# EAGLE design RS232 rev4 (EAGLE 7.5.0)
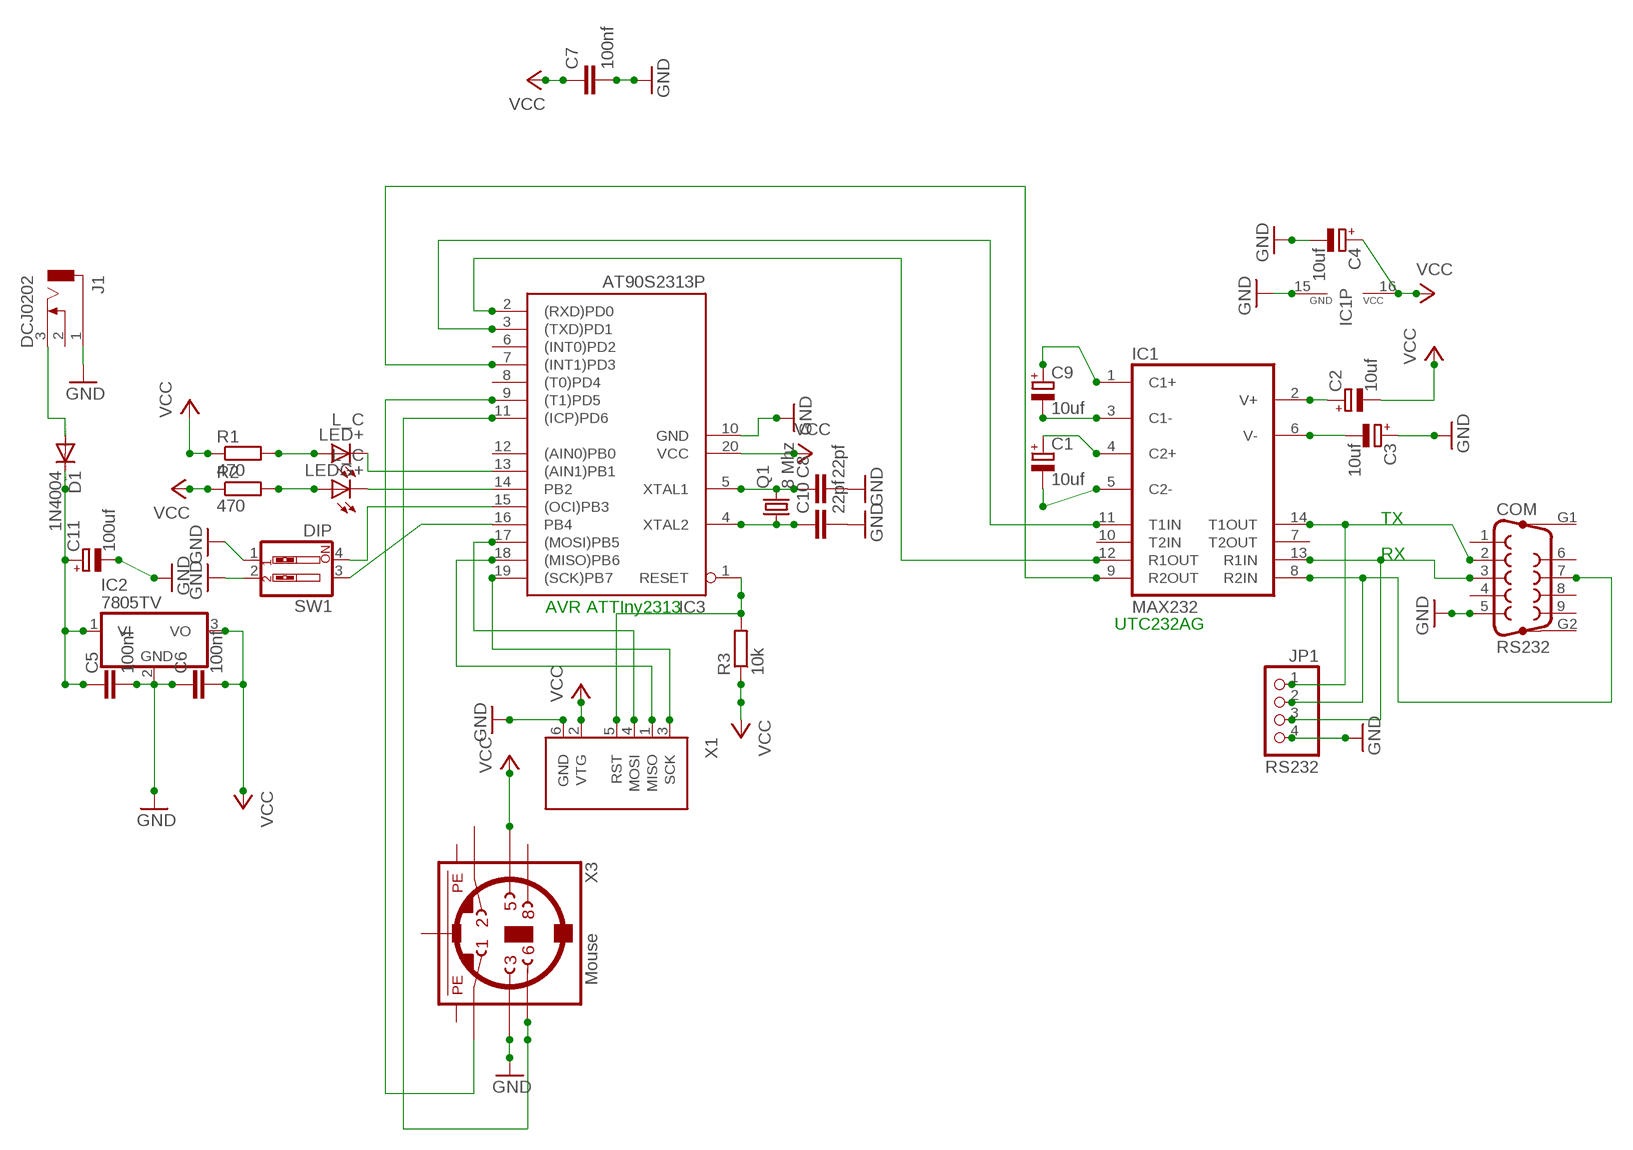
[diagram p0: schematic, sheet 1]

## Parts
C1  10uf  CPOL-EUTT2D4  [TT2D4]
C2  10uf  CPOL-EUTT2D4  [TT2D4]
C3  10uf  CPOL-EUTT2D4  [TT2D4]
C4  10uf  CPOL-EUTT2D4  [TT2D4]
C5  100nf  C-EUC1206  [C1206]
C6  100nf  C-EUC1206  [C1206]
C7  100nf  C-EUC1206  [C1206]
C8  22pf  C-EUC1206  [C1206]
C9  10uf  CPOL-EUTT2D4  [TT2D4]
C10  22pf  C-EUC1206  [C1206]
C11  100uf  CPOL-EUTT2D4  [TT2D4]
COM  RS232  F09HP  [F09HP]
D1  1N4004  [DO41-10]
IC1  MAX232  [DIL16]
IC2  7805TV  [TO220V]
IC3  AT90S2313P  [DIL20]
J1  DCJ0202  [DCJ0202]
JP1  RS232  PINHD-1X4  [1X04]
LED+  L_C  LED3MM  [LED3MM]
LEDG+  L_C  LED3MM  [LED3MM]
Q1  8 Mhz  CRYSTALHC49S  [HC49/S]
R1  470  R-EU_R1206  [R1206]
R2  470  R-EU_R1206  [R1206]
R3  10k  R-EU_R1206  [R1206]
SW1  DIP  SW_DIP-2  [EDG-02]
X1  AVRISP6PINHEADER  [6PINHEADER]
X3  Mouse  MINI_DIN_6  [M_DIN6]

## Nets
GND: C3.+ C4.- C5.2 C6.1 C7.2 C8.2 C10.2 C11.- COM.5 IC1.15(GND) IC2.2(GND) IC3.10(GND) J1.1 JP1.4 SW1.1 SW1.2 X1.6(GND) X3.3
N$1: IC1.11(T1IN) IC3.3((TXD)PD1)
N$2: IC1.12(R1OUT) IC3.2((RXD)PD0)
N$3: C9.- IC1.3(C1-)
N$4: C9.+ IC1.1(C1+)
N$5: C1.+ IC1.4(C2+)
N$6: C1.- IC1.5(C2-)
N$7: IC3.1(RESET) R3.2 X1.5(RST)
N$8: IC3.11((ICP)PD6) X3.6
N$9: COM.2 IC1.14(T1OUT) JP1.1
N$10: C5.1 C11.+ D1.C IC2.1(VI)
N$11: IC1.9(R2OUT) IC3.7((INT1)PD3)
N$12: C8.1 IC3.5(XTAL1) Q1.2
N$13: IC3.14(PB2) LEDG+.K(C)
N$14: C3.- IC1.6(V-)
N$15: C2.+ IC1.2(V+)
N$16: IC3.13((AIN1)PB1) LED+.K(C)
N$17: COM.3 IC1.13(R1IN) JP1.3
N$18: C10.1 IC3.4(XTAL2) Q1.1
N$19: IC3.16(PB4) SW1.3
N$20: LEDG+.A R2.2
N$21: LED+.A R1.2
N$22: IC3.9((T1)PD5) X3.1
N$23: IC3.15((OCI)PB3) SW1.4
N$24: IC3.19((SCK)PB7) X1.3(SCK)
N$26: IC3.17((MOSI)PB5) X1.4(MOSI)
N$27: IC3.18((MISO)PB6) X1.1(MISO)
POWER: D1.A J1.3
SERIAL#: COM.7 IC1.8(R2IN) JP1.2
VCC: C2.- C4.+ C6.2 C7.1 IC1.16(VCC) IC2.3(VO) IC3.20(VCC) R1.1 R2.1 R3.1 X1.2(VTG) X3.5
Unconnected: COM.1 COM.4 COM.6 COM.8 COM.9 COM.G1 COM.G2 IC1.7(T2OUT) IC1.10(T2IN) IC3.6((INT0)PD2) IC3.8((T0)PD4) IC3.12((AIN0)PB0) J1.2 X3.2 X3.8

## Notes on the sheet
- TX
- RX
- AVR ATTIny2313
- UTC232AG

## Power pins joined to a net without a drawn wire
PE1: X3.SH1(PE1)
PE2: X3.SH2(PE2)
PE3: X3.SH3(PE3)

## Library data of the parts
C1-C4 C9 C11 = rcl:CPOL-EU: POLARIZED CAPACITOR, European symbol
C5-C8 C10 = rcl:C-EU: CAPACITOR, European symbol
COM = con-subd:F09HP: SUB-D; OC_FARNELL: unknown; OC_NEWARK: unknown
D1 = diode:1N4004: DIODE general purpose rectifier, 1 A
IC1 = maxim:MAX232: RS232 TRANSCEIVER; MF: MAXIM; MPN: MAX232ACPE+; OC_FARNELL: 9723773; OC_NEWARK: 68K4544
IC2 = linear:78*: Positive VOLTAGE REGULATOR Source: http://cache.national.com/ds/LM/LM78L05.pdf http://www.fairchildsemi.com/ds/LM/LM7805.pdf
IC3 = atmel:AT90S2313: MICROCONTROLLER 2 Kbytes FLASH 128 bytes SRAM 128 bytes EEPROM UART; OC_FARNELL: unknown; OC_NEWARK: unknown
J1 = con-jack:DCJ0202: DC POWER JACK Source: DCJ0202.pdf; OC_FARNELL: unknown; OC_NEWARK: unknown
JP1 = pinhead:PINHD-1X4: PIN HEADER
LED+ LEDG+ = led:LED: LED OSRAM: - CHIPLED LG R971, LG N971, LY N971, LG Q971, LY Q971, LO R971, LY R971 LH N974, LH R974 LS Q976, LO Q976, LY Q976 LO Q996 - Hyper CHIPLED LW Q18S LB Q993, LB Q99A, LB R99A - SideLED LS A670, LO A670, LY A670, LG A670, LP A670 LB A673, LV A673, LT A673, LW A673 LH A674 LY A675 LS A676, LA A676, LO A676, LY A676, LW A676 LS A679, LY A679, LG A679 - Hyper Micro SIDELED® LS Y876, LA Y876, LO Y876, LY Y876 LT Y87S - SmartLED LW L88C, LW L88S LB L89C, LB L89S, LG L890 LS L89K, LO L89K, LY L89K LS L896, LA L896, LO L896, LY L896 - TOPLED LS T670, LO T670, LY T670, LG T670, LP T670 LSG T670, LSP T670, LSY T670, LOP T670, LYG T670 LG T671, LOG T671, LSG T671 LB T673, LV T673, LT T673, LW T673 LH T674 LS T676, LA T676, LO T676, LY T676, LB T676, LH T676, LSB T676, LW T676 LB T67C, LV T67C, LT T67C, LS T67K, LO T67K, LY T67K, LW E67C LS E67B, LA E67B, LO E67B, LY E67B, LB E67C, LV E67C, LT E67C LW T67C LS T679, LY T679, LG T679 LS T770, LO T770, LY T770, LG T770, LP T770 LB T773, LV T773, LT T773, LW T773 LH T774 LS E675, LA E675, LY E675, LS T675 LS T776, LA T776, LO T776, LY T776, LB T776 LHGB T686 LT T68C, LB T68C - Hyper Mini TOPLED® LB M676 - Mini TOPLED Santana® LG M470 LS M47K, LO M47K, LY M47K Source: http://www.osram.convergy.de LUXEON: - LUMILED® LXK2-PW12-R00, LXK2-PW12-S00, LXK2-PW14-U00, LXK2-PW14-V00 LXK2-PM12-R00, LXK2-PM12-S00, LXK2-PM14-U00 LXK2-PE12-Q00, LXK2-PE12-R00, LXK2-PE12-S00, LXK2-PE14-T00, LXK2-PE14-U00 LXK2-PB12-K00, LXK2-PB12-L00, LXK2-PB12-M00, LXK2-PB14-N00, LXK2-PB14-P00, LXK2-PB14-Q00 LXK2-PR12-L00, LXK2-PR12-M00, LXK2-PR14-Q00, LXK2-PR14-R00 LXK2-PD12-Q00, LXK2-PD12-R00, LXK2-PD12-S00 LXK2-PH12-R00, LXK2-PH12-S00 LXK2-PL12-P00, LXK2-PL12-Q00, LXK2-PL12-R00 Source: www.luxeon.com KINGBRIGHT: KA-3528ASYC Source: www.kingbright.com
Q1 = crystal:CRYSTAL: CRYSTAL; OC_FARNELL: 1667008; OC_NEWARK: unknown
R1-R3 = rcl:R-EU_: RESISTOR, European symbol
SW1 = special:SW_DIP-2: DIP SWITCH
X1 = avrisp:AVRISP6PIN
X3 = mini_din:MINI_DIN_6

## Board
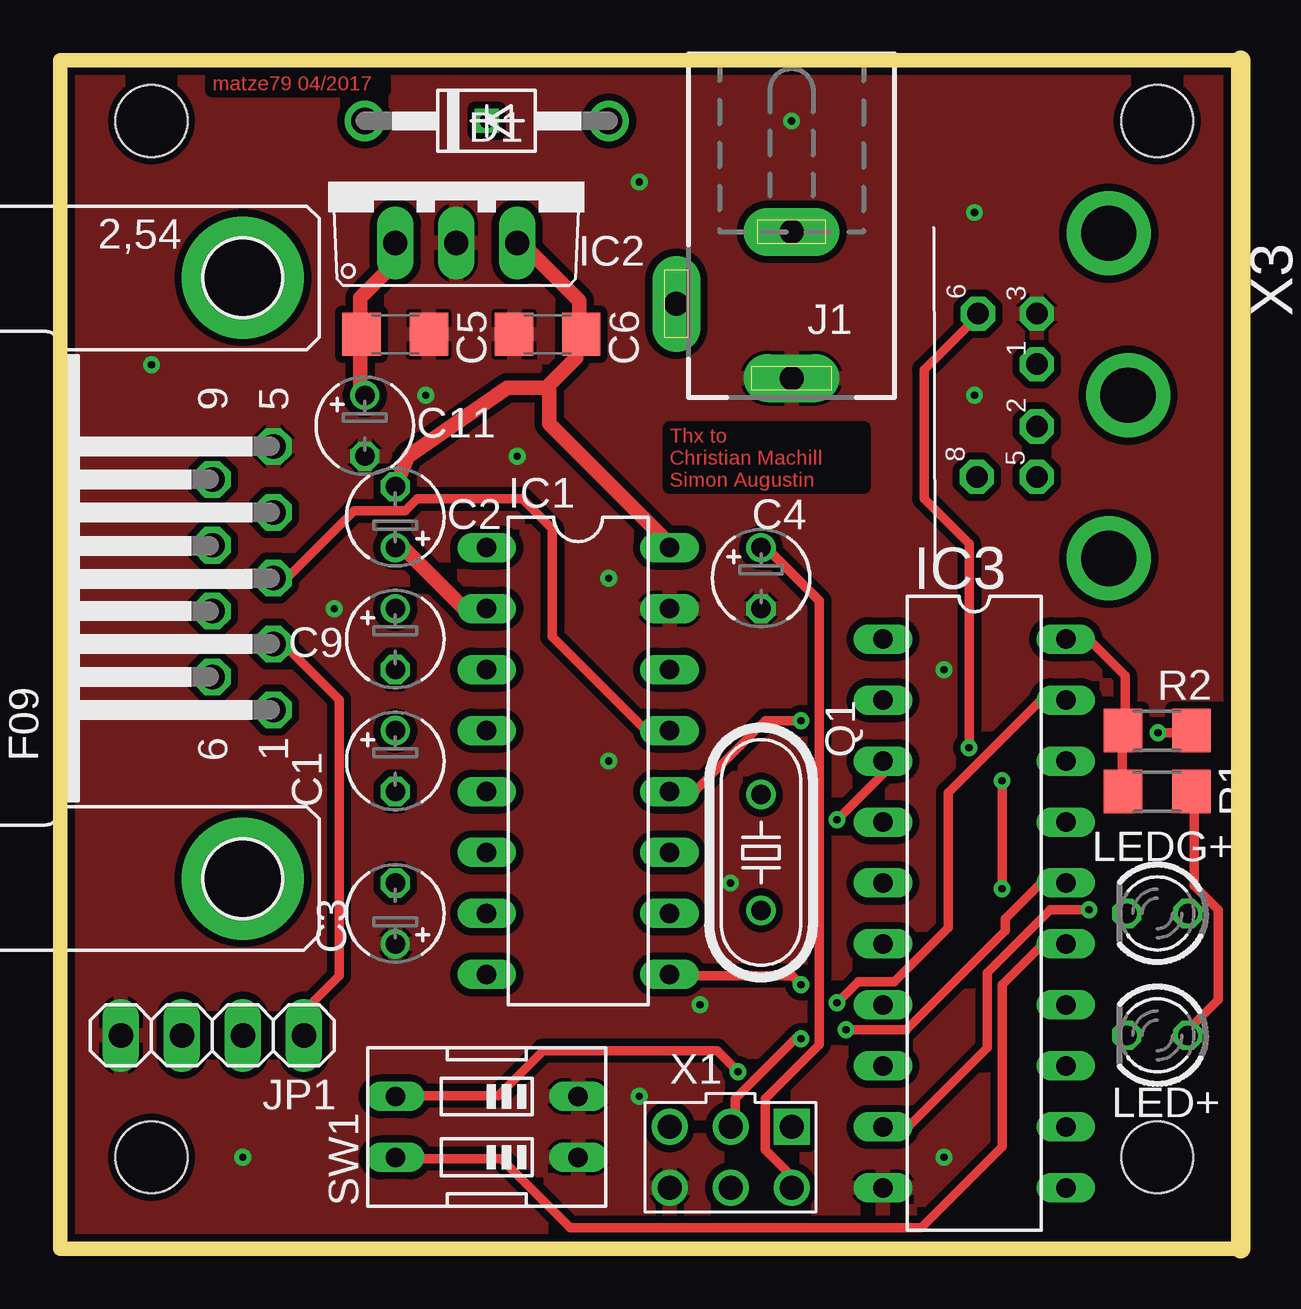
[diagram p1: board, top side]
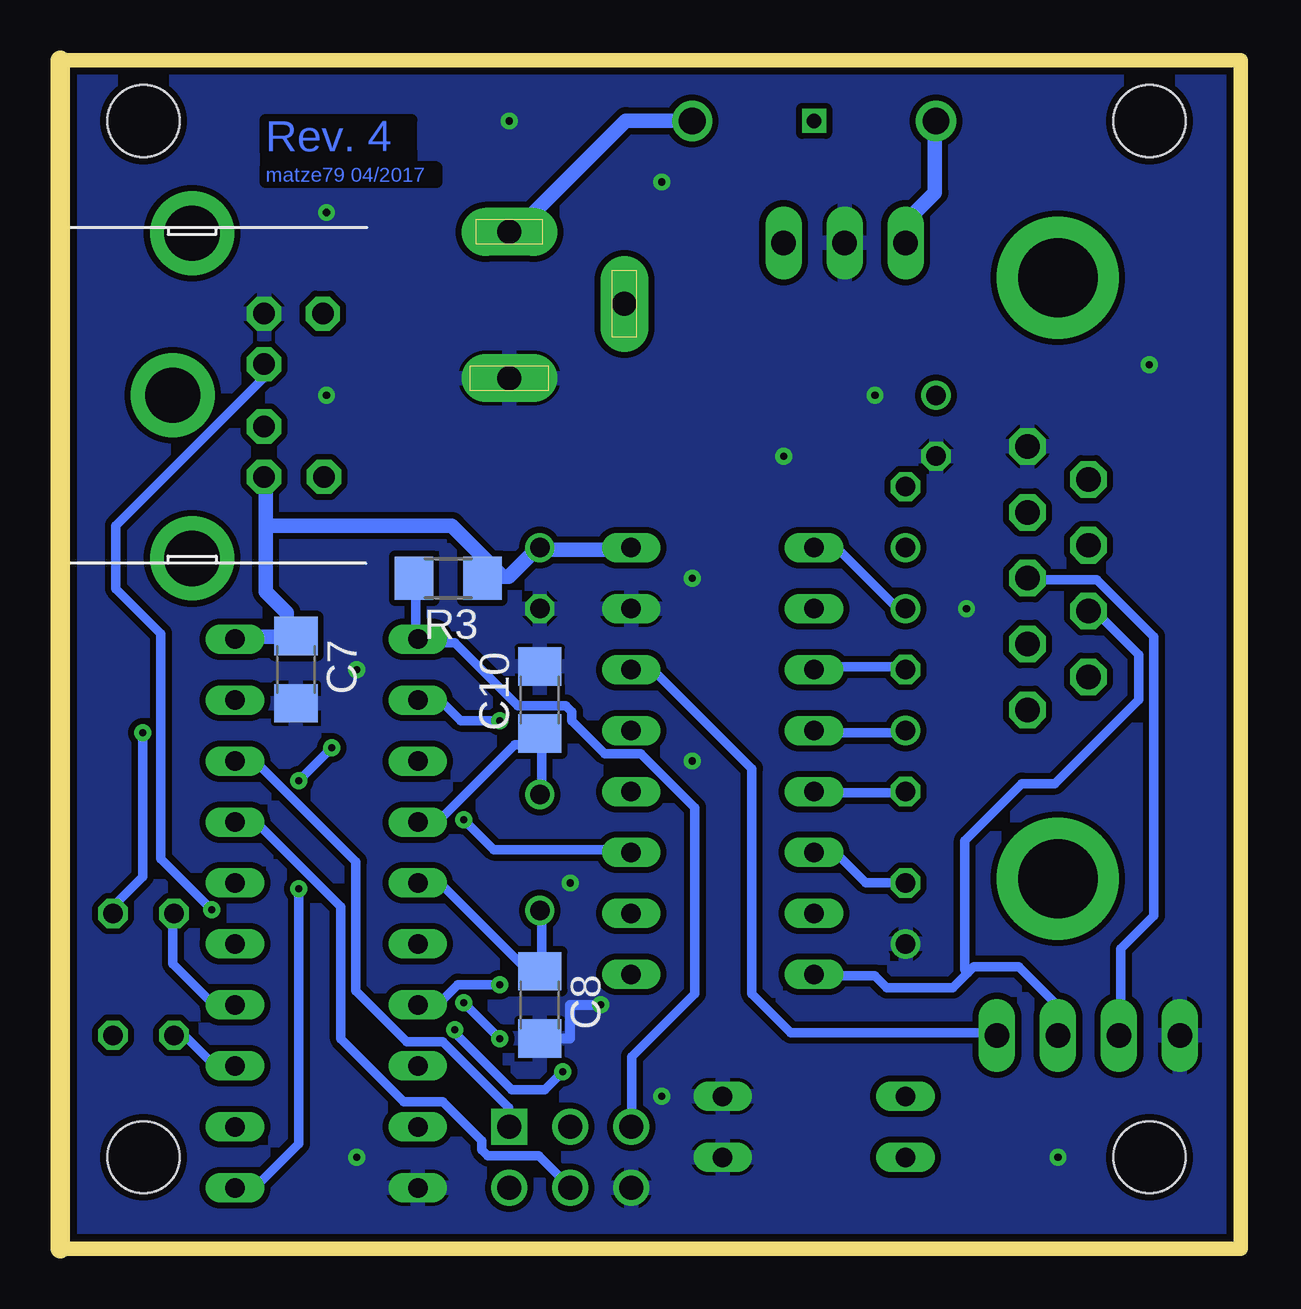
[diagram p2: board, bottom side, seen from below]

Size 49.2 x 49.53 mm. Coordinates in mm from the lower left corner, seen from the top.
Outline: 49.2,49.52 49.2,0 0,0 0,49.53 49.2,49.53
Copper layers (1*16): Top 0.035mm / dielectric 1.5mm / Bottom 0.035mm
Design rules "platinensammler_02 *": minimum track width 0.4mm, minimum drill 0.3mm, track to track 0.15mm, track to pad 0.15mm, pad to pad 0.15mm, via to via 0.15mm, smd to smd 0mil, copper to edge 0.3mm, drill to drill 0.2mm, minimum pad ring 0.2mm, minimum via ring 0.2mm, stop-mask expansion 4mil, vias tented up to drill 0.8mm, thermal gap 0.15mm
Holes 3 mm at 45.72,46.99 45.72,3.81 3.81,3.81 3.81,46.99

### Footprints (pad centres in the part's own frame; a part is rotated, then mirrored left to right if it is on the bottom)
TT2D4 = drill 0.813: + -1.27,0 | drill 0.813 octagon: - 1.27,0
C1206 = smd 1.6 x 1.8: 1 -1.4,0; 2 1.4,0
F09HP = drill 1.016 octagon: 1 -5.486,-1.27; 2 -2.743,-1.27; 3 0,-1.27; 4 2.743,-1.27; 5 5.486,-1.27; 6 -4.115,1.27; 7 -1.372,1.27; 8 1.372,1.27; 9 4.115,1.27 | drill 3.302 pad 5.08: G1 -12.522,0; G2 12.522,0
DO41-10 = drill 1.118: A 5.08,0; C -5.08,0
DIL16 = drill 0.813 long: 1 -8.89,-3.81; 2 -6.35,-3.81; 3 -3.81,-3.81; 4 -1.27,-3.81; 5 1.27,-3.81; 6 3.81,-3.81; 7 6.35,-3.81; 8 8.89,-3.81; 9 8.89,3.81; 10 6.35,3.81; 11 3.81,3.81; 12 1.27,3.81; 13 -1.27,3.81; 14 -3.81,3.81; 15 -6.35,3.81; 16 -8.89,3.81
TO220V = drill 1.016 long: 1 -2.54,-2.54; 2 0,-2.54; 3 2.54,-2.54
DIL20 = drill 0.813 long: 1 -11.43,-3.81; 2 -8.89,-3.81; 3 -6.35,-3.81; 4 -3.81,-3.81; 5 -1.27,-3.81; 6 1.27,-3.81; 7 3.81,-3.81; 8 6.35,-3.81; 9 8.89,-3.81; 10 11.43,-3.81; 11 11.43,3.81; 12 8.89,3.81; 13 6.35,3.81; 14 3.81,3.81; 15 1.27,3.81; 16 -1.27,3.81; 17 -3.81,3.81; 18 -6.35,3.81; 19 -8.89,3.81; 20 -11.43,3.81
DCJ0202 = drill 1 pad 2 long: 1 0,3.1; 2 4.8,0; 3 0,-3
1X04 = drill 1.016 long: 1 -3.81,0; 2 -1.27,0; 3 1.27,0; 4 3.81,0
LED3MM = drill 0.813 octagon: A -1.27,0; K 1.27,0
HC49/S = drill 0.813: 1 -2.413,0; 2 2.413,0
R1206 = smd 1.6 x 1.803: 1 -1.422,0; 2 1.422,0
EDG-02 = drill 0.813 long: 1 -1.27,-3.81; 2 1.27,-3.81; 3 1.27,3.81; 4 -1.27,3.81
6PINHEADER = drill 1 square: 1 -1.27,2.54 | drill 1: 2 1.27,2.54; 3 -1.27,0; 4 1.27,0; 5 -1.27,-2.54; 6 1.27,-2.54
M_DIN6 = drill 0.9 pad 1.422 octagon: 1 -1.3,-3.75; 2 1.3,-3.75; 3 -3.4,-3.75; 5 3.4,-3.75; 6 -3.4,-6.2; 8 3.4,-6.25 | drill 2.3 pad 3.5: SH1 6.8,-0.75; SH2 0,0.05; SH3 -6.75,-0.75

### Placement (x,y rotation side)
C1  13.97,20.32 270 top
C2  13.97,30.48 90 top
C3  13.97,13.97 90 top
C4  29.21,27.94 270 top
C5  13.97,38.1 0 top
C6  20.32,38.1 0 top
C7  39.37,24.13 270 bottom
C8  29.21,10.16 270 bottom
C9  13.97,25.4 270 top
C10  29.21,22.86 90 bottom
C11  12.7,34.29 270 top
COM  7.62,27.94 90 top
D1  17.78,46.99 0 top
IC1  21.59,20.32 270 top
IC2  16.51,44.45 0 top
IC3  38.1,13.97 270 top
J1  30.48,39.37 180 top
JP1  6.35,8.89 180 top
LED+  45.72,8.89 180 top
LEDG+  45.72,13.97 180 top
Q1  29.21,16.51 270 top
R1  45.72,19.05 0 top
R2  45.72,21.59 0 top
R3  33.02,27.94 180 bottom
SW1  17.78,5.08 90 top
X1  27.94,3.81 270 top
X3  44.45,35.56 270 top

### Tracks (layer width: path | path; a pad name or v marks a point on that pad's centre or on a via)
GND  (via drill 0.3)
  Bottom 0.4: C7.2 39.5,23 39.47,23
  Bottom 0.406: C8.2 27.94,8.76 27.94,10.16 v26.67,10.16
  other vias: 36.83,3.81 7.62,3.81 24.13,6.35 27.94,15.24 22.86,20.32 22.86,27.94 3.81,36.83 11.43,26.67 15.24,35.56 19.05,33.02 24.13,44.45 30.48,46.99 38.1,35.56 36.83,24.13 38.1,43.18
  pour Bottom (isolate 0.254): 0,49.53 49.53,49.53 49.53,0 0,0
  pour Top (isolate 0.305): 0,49.53 0,0 49.53,0 49.53,49.53
N$1  (via drill 0.3)
  Top 0.4: v32.38,17.88 34.38,19.88 34.38,20.25 IC3.3
  Bottom 0.4: v32.38,17.88 31.12,16.62 25.5,16.62 IC1.11
N$2  (via drill 0.3)
  Top 0.4: v30.88,22 29.38,22 26.5,19.12 25.5,19.12 IC1.12
  Bottom 0.4: v30.88,22 32.5,22 33.25,22.75 34.25,22.75 IC3.2
N$3
  Bottom 0.4: C9.- 14,24.25 17.75,24.25 IC1.3
N$4
  Bottom 0.4: C9.+ 14,26.75 14.38,26.75 16.75,29.12 17.75,29.12 IC1.1
N$5
  Bottom 0.4: C1.+ 14,21.5 17.75,21.5 IC1.4
N$6
  Bottom 0.4: C1.- 14,19 17.75,19 IC1.5
N$7
  Bottom 0.4: R3.2 34.38,27.88 34.38,25.5 IC3.1 34.25,25.25 32.75,25.25 30.12,22.62 28.12,22.62 27.88,22.38 27.88,22 26.5,20.62 25,20.62 22.75,18.38 22.75,10.62 25.38,8 25.38,5.12 X1.5
N$8  (via drill 0.3)
  Top 0.4: v39.25,19.5 v39.25,15 | v37.88,20.88 37.88,29.38 36,31.25 36,36.62 38.25,38.88 X3.6
  Bottom 0.4: v39.25,15 39.25,4.38 41,2.62 41.88,2.62 IC3.11 | v37.88,20.88 v39.25,19.5
N$9
  Top 0.4: COM.2 9,25.12 9.38,25.12 11.62,22.88 11.62,11.38 10.25,10 10.25,9 JP1.1
  Bottom 0.4: IC1.14 25.38,24.12 24.5,24.12 20.38,20 20.38,10.62 18.75,9 10.25,9 JP1.1
N$10
  Top 0.4: 12.5,38 C5.1 | 12.62,35.62 C11.+
  Top 0.61: 12.5,38 12.5,35.75 12.62,35.62 | IC2.1 13.88,41.88 13.88,41 12.5,39.62 12.5,38.25 C5.1
  Bottom 0.4: 13.88,42 13.88,42.88 | 12.75,46.88 D1.C
  Bottom 0.61: 12.75,46.88 12.75,44 13.88,42.88 | 13.88,42 IC2.1
N$11  (via drill 0.3)
  Top 0.4: v30.88,11 30.5,11.38 25.5,11.38 IC1.9
  Bottom 0.4: v30.88,11 32.62,11 33.38,10.25 34.25,10.25 IC3.7
N$12
  Bottom 0.4: Q1.2 29.12,14 29.12,11.62 C8.1 29.38,11.62 29.75,11.62 33.25,15.12 34.25,15.12 IC3.5
N$13
  Bottom 0.4: IC3.14 42,10.25 42.88,10.25 44.5,11.88 44.5,13.88 LEDG+.K
N$14
  Bottom 0.4: C3.- 14,15.25 15.62,15.25 16.88,16.5 17.75,16.5 IC1.6
N$15
  Top 0.4: 14.38,29.12 14,29.12 | 17.75,26.75 IC1.2
  Top 0.61: 14.38,29.12 16.75,26.75 17.75,26.75 | 14,29.12 C2.+
N$16
  Bottom 0.4: IC3.13 42,7.62 42.75,7.62 44,8.88 44.38,8.88 LED+.K
N$17
  Top 0.4: IC1.13 25.38,21.62 24.38,21.62 20.5,25.5 20.5,30 19.25,31.25 14.88,31.25 14.38,30.75 12.25,30.75 9.5,28 9,28 COM.3
  Bottom 0.4: JP1.3 5,9 5,12.5 3.62,13.88 3.62,25.5 6,27.88 8.88,27.88 COM.3
N$18
  Bottom 0.4: Q1.1 29.12,19 29.12,21.38 C10.1 29.25,21 30.25,21 33.38,17.88 34.25,17.88 IC3.4
N$19  (via drill 0.3)
  Top 0.4: v28.25,7.38 27.38,8.25 20.12,8.25 18.25,6.38 14,6.38 SW1.3 | v32.75,9.12 35.25,9.12 39.38,13.25 39.38,13.75 40.88,15.25 41.88,15.25 IC3.16
  Bottom 0.4: v28.25,7.38 29,6.62 30.38,6.62 32.75,9 v32.75,9.12
N$20  (via drill 0.3)
  Top 0.4: v45.75,21.5 47.12,21.5 R2.2
  Bottom 0.4: v45.75,21.5 45.75,15.5 46.88,14.38 46.88,14 LEDG+.A
N$21
  Top 0.4: R1.2 47.25,19 47.25,15.12 48.25,14.12 48.25,10.38 46.88,9 LED+.A
N$22  (via drill 0.3)
  Top 0.4: v42.88,14.12 41.25,14.12 38.62,11.5 38.62,8.38 35.38,5.12 34.38,5.12 IC3.9
  Bottom 0.4: v42.88,14.12 45,16.25 45,25.62 46.88,27.5 46.88,30.12 40.75,36.25 40.75,36.75 X3.1
N$23
  Top 0.4: SW1.4 14,3.75 18.38,3.75 21.25,0.88 35.88,0.88 39.25,4.25 39.25,11 40.88,12.62 41.88,12.62 IC3.15
N$24  (via drill 0.3)
  Top 0.4: v32.38,10.25 33.25,11.12 34.75,11.12 37,13.38 37,19 40.75,22.75 41.88,22.75 IC3.19 | v30.88,8.75 30.62,8.75 28.12,6.25 28.12,5.25 28,5.12 X1.3
  Bottom 0.4: v30.88,8.75 v32.38,10.25
N$26
  Bottom 0.4: IC3.17 41.88,17.75 41,17.75 37.5,14.25 37.5,8.75 34.88,6.12 33.25,6.12 31.62,4.5 31.62,4.12 31.38,3.88 29.25,3.88 28,2.62 X1.4
N$27
  Bottom 0.4: IC3.18 41.88,20.25 41,20.25 36.88,16.12 36.88,10.75 34.75,8.62 33.25,8.62 30.5,5.88 30.5,5.12 X1.1
N$35  (via drill 0.6)
  other vias: 17.78,46.99
POWER
  Bottom 0.61: D1.A 22.88,47 25.62,47 30.38,42.25 J1.3
SERIAL#
  Bottom 0.4: 11.38,11.5 11.12,11.75 9.25,11.75 7.62,10.12 7.62,9 JP1.2 | 11.38,11.5 12,10.88 14.75,10.88 15.25,11.38 17.75,11.38 IC1.8 | COM.7 6.25,26.5 6,26.5 4.25,24.75 4.25,22.88 7.75,19.38 9.12,19.38 11.5,17 11.5,11.62 11.38,11.5
VCC
  Top 0.4: 21.62,38.12 C6.2 21.5,38 21.5,37.12 | 19.12,42 IC2.3 | R1.1 44.25,19.12 44.25,21.5 R2.1 44.38,21.75 44.38,23.88 42.88,25.38 42,25.38 IC3.20 | 31.62,27 31.62,8.5 29.38,6.25 29.38,4.12 30.38,3.12 30.38,2.62 X1.2 | 29.25,29.12 C4.+ | 20.38,35.75 20.25,35.88 | 25.5,29.25 IC1.16
  Top 0.406: 29.5,29.12 31.62,27
  Top 0.61: 21.62,38.12 21.62,39.5 19.12,42 | C2.- 14.5,33.02 18.62,35.88 20.25,35.88 21.5,37.12 | 29.25,29.12 29.5,29.12 | 20.38,35.75 20.38,34.38 25.5,29.25
  Bottom 0.4: 39.38,25.5 C7.1 39.75,25.62 | 41.88,25.5 IC3.20 | 40.62,32.12 X3.5 | 31.5,28 R3.1 | 29.25,29.25 C4.+ 29.12,29.12 | 25.5,29.12 IC1.16
  Bottom 0.61: 41.88,25.5 39.38,25.5 | 40.62,30.12 40.62,27.38 39.75,26.5 39.75,25.62 | 40.62,30.12 40.62,32.12 | 31.5,28 30.5,28 29.25,29.25 | 29.12,29.12 25.5,29.12 | 40.62,30.12 32.88,30.12 30.88,28.12 R3.1

### Text on the board
Top: matze79 04/2017 | Thx to / Christian Machill / Simon Augustin
Bottom: Rev. 4 | matze79 04/2017